# Altium schematic sheet ROM.SchDoc
size A4
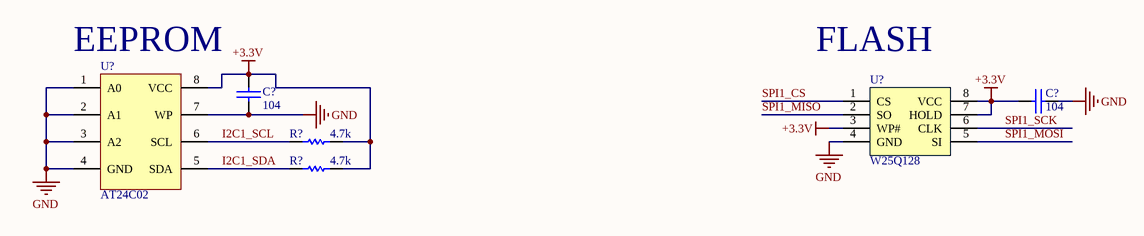
[diagram p0: ROM.SchDoc]

## Parts
(Parts that share a designator on the sheet are numbered #1, #2 ... from top to bottom, then left to right.)
C?#1  104  [0603C]
C?#2  104  [0603C]
R?#1  4.7k  [0603R]
R?#2  4.7k  [0603R]
U?#1  AT24C02  [SOP8]
U?#2  W25Q128  [SOIC8]

## Nets
+3.3V: C?#1.2 C?#2.2 R?#1.2 R?#2.2 U?#1.8(VCC) U?#2.3(WP#) U?#2.7(HOLD) U?#2.8(VCC)
GND: C?#1.1 C?#2.1 U?#1.1(A0) U?#1.2(A1) U?#1.3(A2) U?#1.4(GND) U?#1.7(WP) U?#2.4(GND)
I2C1_SCL: R?#1.1 U?#1.6(SCL)
I2C1_SDA: R?#2.1 U?#1.5(SDA)
SPI1_CS: U?#2.1(CS)
SPI1_MISO: U?#2.2(SO)
SPI1_MOSI: U?#2.5(SI)
SPI1_SCK: U?#2.6(CLK)

## Notes on the sheet
- (near U?#1) EEPROM
- (near U?#2) FLASH

## Library data of the parts
C?#1 C?#2 = CAP: 无极性电容
R?#1 R?#2 = RES